# Altium schematic sheet Thermometer_Schematic.SchDoc
size 482 x 406 mm
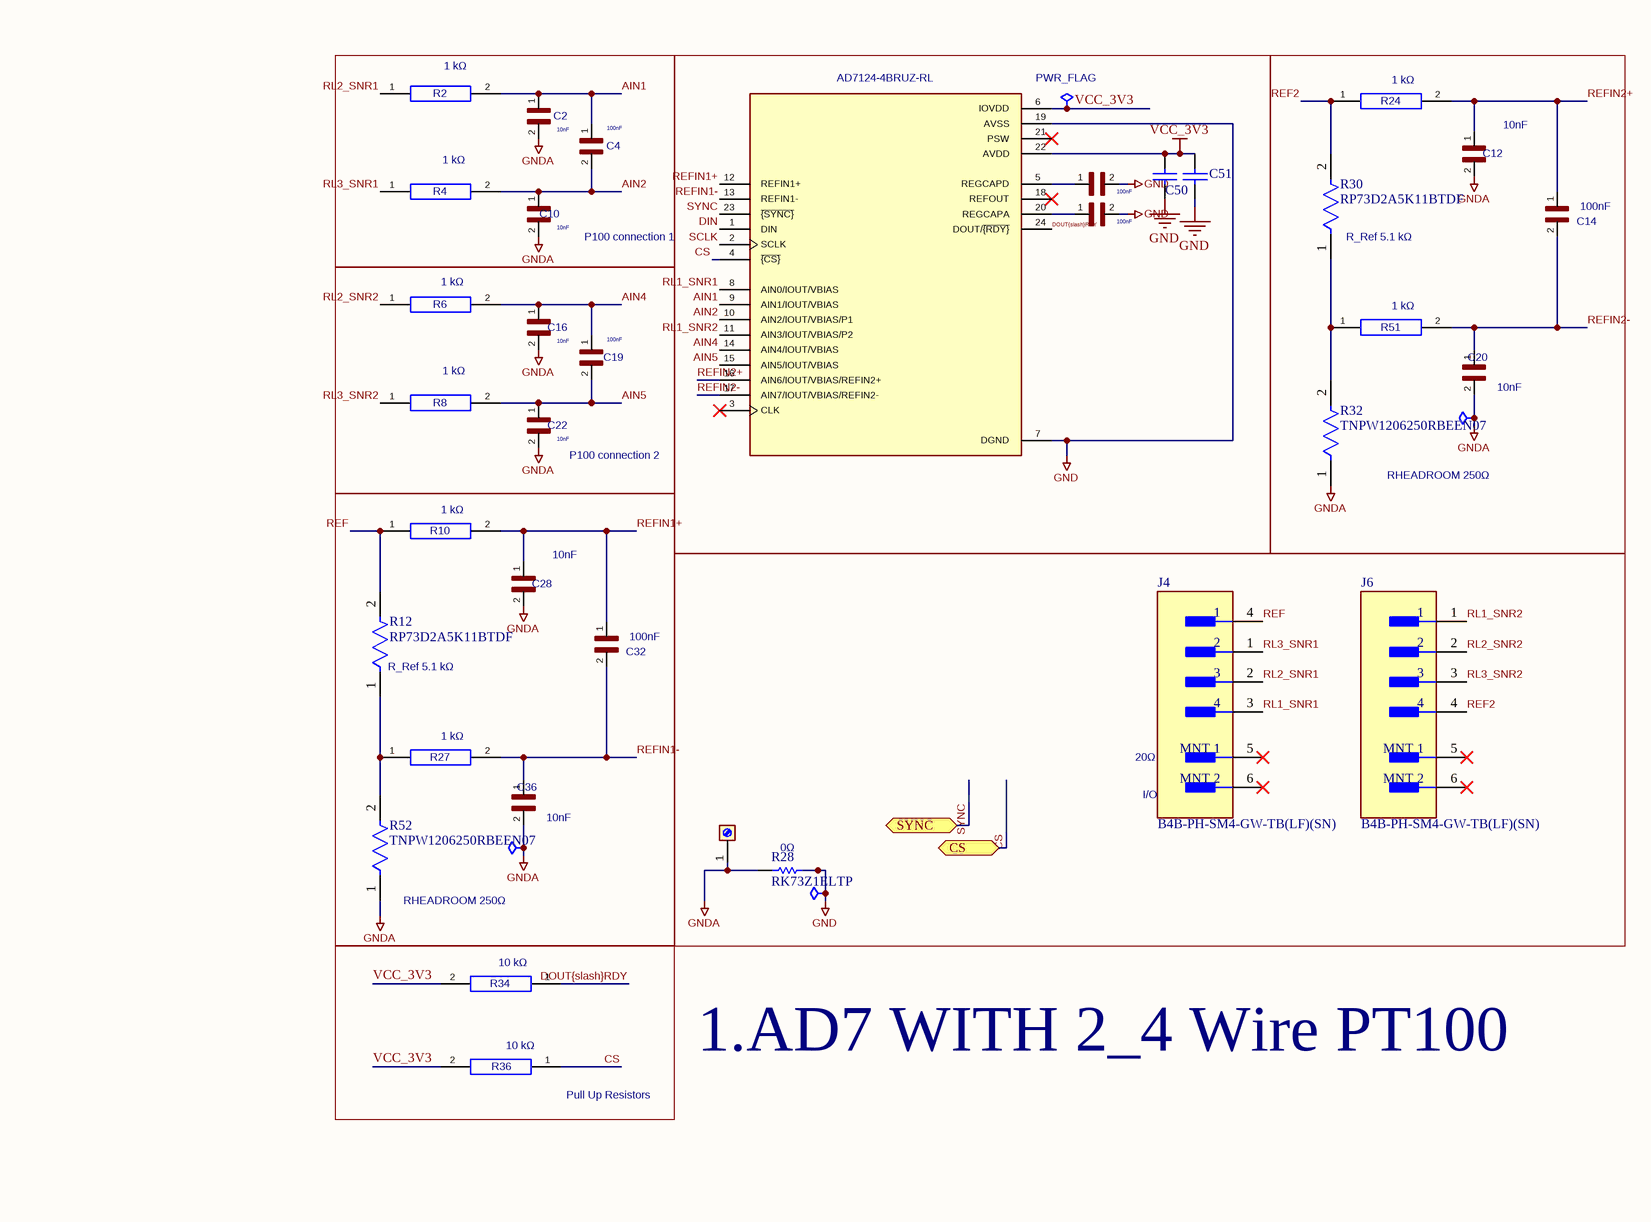
[diagram p0: Thermometer_Schematic.SchDoc, top left]
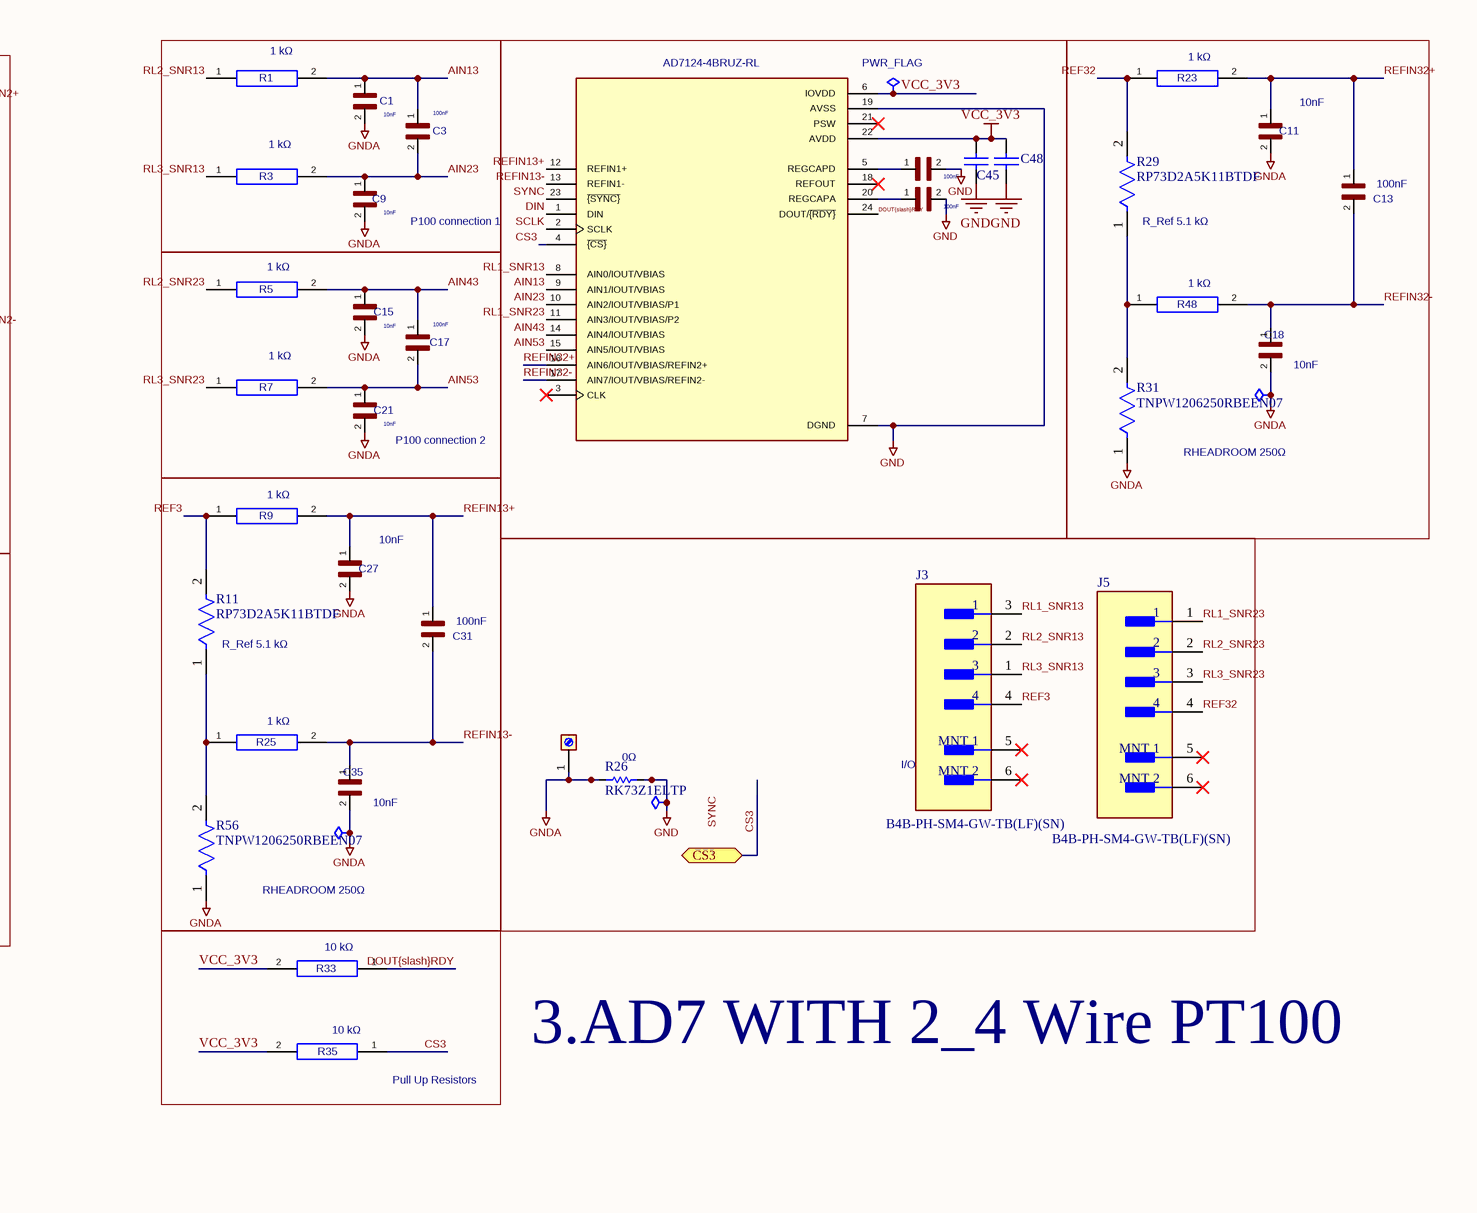
[diagram p1: Thermometer_Schematic.SchDoc, top right]
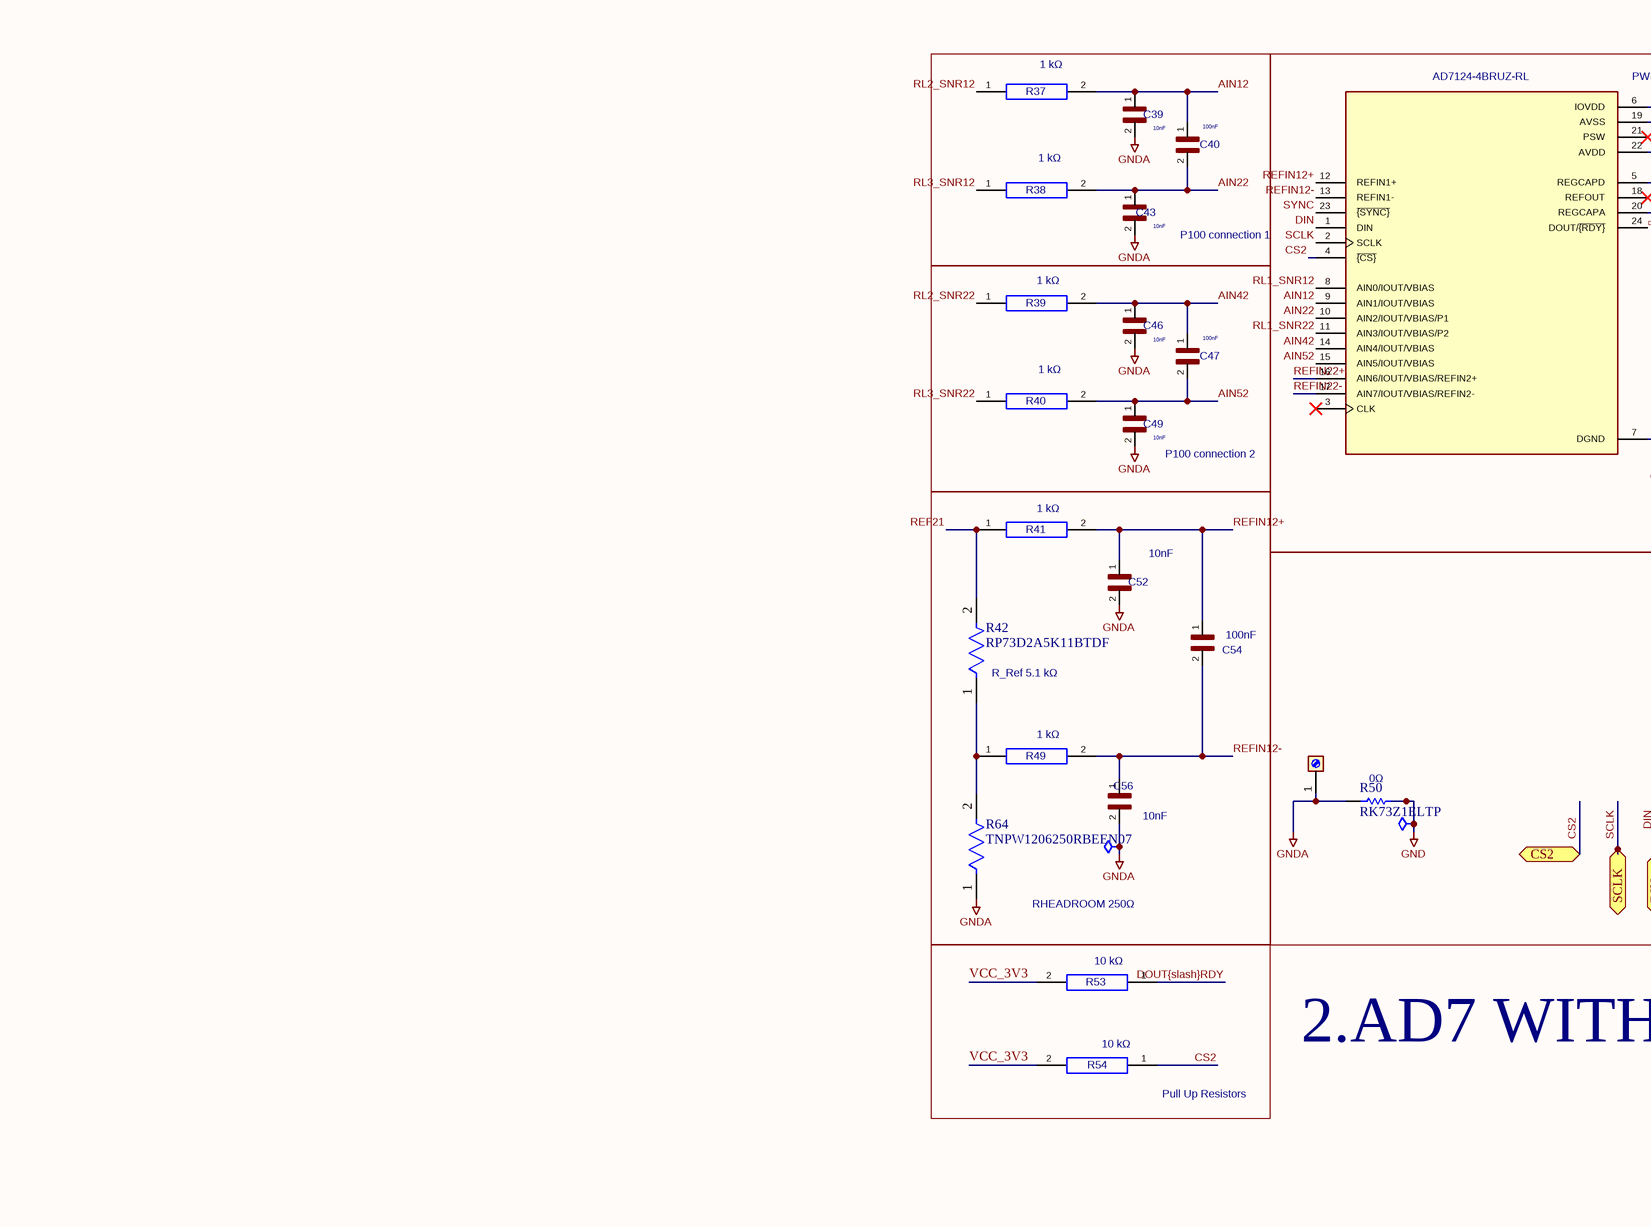
[diagram p2: Thermometer_Schematic.SchDoc, bottom left]
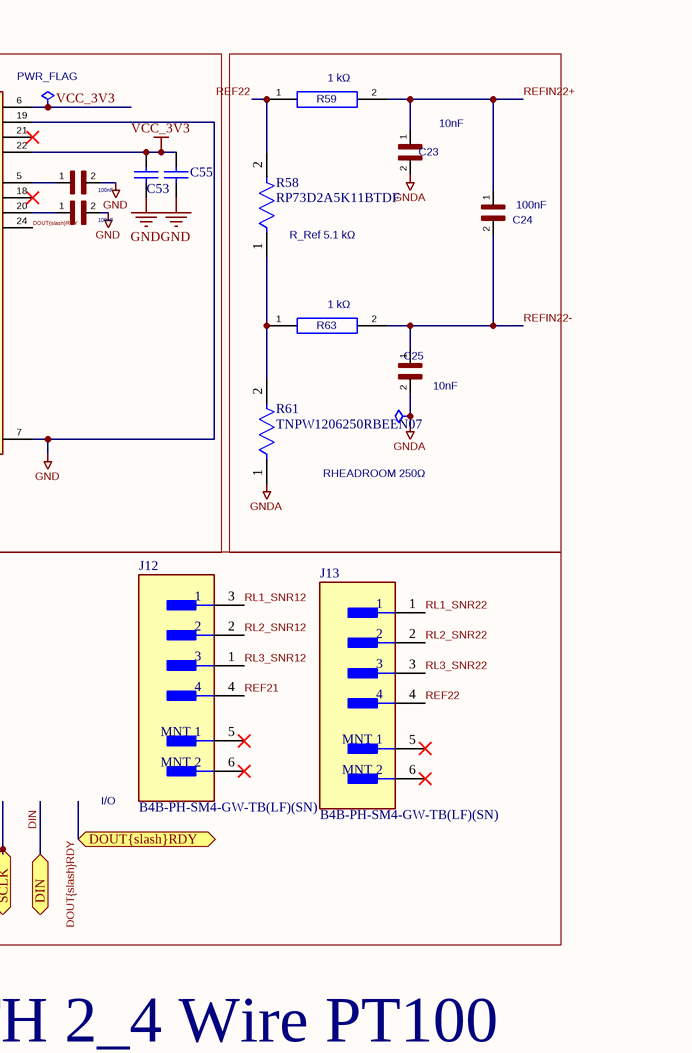
[diagram p3: Thermometer_Schematic.SchDoc, bottom right]

## Parts
#FLG02  PWR_FLAG  (value not drawn)  (graphical)
#FLG03  PWR_FLAG  (value not drawn)  (graphical)
#FLG05  PWR_FLAG  (graphical)
#FLG?#1  PWR_FLAG  (graphical)
#FLG?#2  PWR_FLAG  (value not drawn)  (graphical)
#FLG?#3  PWR_FLAG  (value not drawn)  (graphical)
#FLG?#4  PWR_FLAG  (value not drawn)  (graphical)
#FLG?#5  PWR_FLAG  (value not drawn)  (graphical)
#FLG?#6  PWR_FLAG  (graphical)
#FLG?#7  PWR_FLAG  (value not drawn)  (graphical)
#FLG?#8  PWR_FLAG  (value not drawn)  (graphical)
#FLG?#9  PWR_FLAG  (value not drawn)  (graphical)
C1  GCM155R71H103KA55D  [CAPC1005X55N]  (value not drawn)
C2  GCM155R71H103KA55D  [CAPC1005X55N]  (value not drawn)
C3  08055C104J4Z2A  [CAPC2012X94N]  (value not drawn)
C4  08055C104J4Z2A  [CAPC2012X94N]  (value not drawn)
C5  08055C104J4Z2A  [CAPC2012X94N]  (value not drawn)
C6  08055C104J4Z2A  [CAPC2012X94N]  (value not drawn)
C7  08055C104J4Z2A  [CAPC2012X94N]  (value not drawn)
C8  08055C104J4Z2A  [CAPC2012X94N]  (value not drawn)
C9  GCM155R71H103KA55D  [CAPC1005X55N]  (value not drawn)
C10  GCM155R71H103KA55D  [CAPC1005X55N]  (value not drawn)
C11  GCM155R71H103KA55D  [CAPC1005X55N]  (value not drawn)
C12  GCM155R71H103KA55D  [CAPC1005X55N]  (value not drawn)
C13  08055C104J4Z2A  [CAPC2012X94N]  (value not drawn)
C14  08055C104J4Z2A  [CAPC2012X94N]  (value not drawn)
C15  GCM155R71H103KA55D  [CAPC1005X55N]  (value not drawn)
C16  GCM155R71H103KA55D  [CAPC1005X55N]  (value not drawn)
C17  08055C104J4Z2A  [CAPC2012X94N]  (value not drawn)
C18  GCM155R71H103KA55D  [CAPC1005X55N]  (value not drawn)
C19  08055C104J4Z2A  [CAPC2012X94N]  (value not drawn)
C20  GCM155R71H103KA55D  [CAPC1005X55N]  (value not drawn)
C21  GCM155R71H103KA55D  [CAPC1005X55N]  (value not drawn)
C22  GCM155R71H103KA55D  [CAPC1005X55N]  (value not drawn)
C23  GCM155R71H103KA55D  [CAPC1005X55N]  (value not drawn)
C24  08055C104J4Z2A  [CAPC2012X94N]  (value not drawn)
C25  GCM155R71H103KA55D  [CAPC1005X55N]  (value not drawn)
C27  GCM155R71H103KA55D  [CAPC1005X55N]  (value not drawn)
C28  GCM155R71H103KA55D  [CAPC1005X55N]  (value not drawn)
C31  08055C104J4Z2A  [CAPC2012X94N]  (value not drawn)
C32  08055C104J4Z2A  [CAPC2012X94N]  (value not drawn)
C35  GCM155R71H103KA55D  [CAPC1005X55N]  (value not drawn)
C36  GCM155R71H103KA55D  [CAPC1005X55N]  (value not drawn)
C39  GCM155R71H103KA55D  [CAPC1005X55N]  (value not drawn)
C40  08055C104J4Z2A  [CAPC2012X94N]  (value not drawn)
C41  08055C104J4Z2A  [CAPC2012X94N]  (value not drawn)
C42  08055C104J4Z2A  [CAPC2012X94N]  (value not drawn)
C43  GCM155R71H103KA55D  [CAPC1005X55N]  (value not drawn)
C45  0805ZC105KAZ2A  [CAPC2013X140X50LL20T25]  (value not drawn)
C46  GCM155R71H103KA55D  [CAPC1005X55N]  (value not drawn)
C47  08055C104J4Z2A  [CAPC2012X94N]  (value not drawn)
C48  C0603X104M3RACTU  [CAPC1608X87X35LL15T15]  (value not drawn)
C49  GCM155R71H103KA55D  [CAPC1005X55N]  (value not drawn)
C50  0805ZC105KAZ2A  [CAPC2013X140X50LL20T25]  (value not drawn)
C51  C0603X104M3RACTU  [CAPC1608X87X35LL15T15]  (value not drawn)
C52  GCM155R71H103KA55D  [CAPC1005X55N]  (value not drawn)
C53  0805ZC105KAZ2A  [CAPC2013X140X50LL20T25]  (value not drawn)
C54  08055C104J4Z2A  [CAPC2012X94N]  (value not drawn)
C55  C0603X104M3RACTU  [CAPC1608X87X35LL15T15]  (value not drawn)
C56  GCM155R71H103KA55D  [CAPC1005X55N]  (value not drawn)
J3  B4B-PH-SM4-GW-TB(LF)(SN)  [FP-B4B-PH-SM4-GW-TB_LF_S-MFG]
J4  B4B-PH-SM4-GW-TB(LF)(SN)  [FP-B4B-PH-SM4-GW-TB_LF_S-MFG]
J5  B4B-PH-SM4-GW-TB(LF)(SN)  [FP-B4B-PH-SM4-GW-TB_LF_S-MFG]
J6  B4B-PH-SM4-GW-TB(LF)(SN)  [FP-B4B-PH-SM4-GW-TB_LF_S-MFG]
J7  GND  [PinHeader_1x01_P2.54mm_Vertical]  (value not drawn)
J9  GND  [PinHeader_1x01_P2.54mm_Vertical]  (value not drawn)
J12  B4B-PH-SM4-GW-TB(LF)(SN)  [FP-B4B-PH-SM4-GW-TB_LF_S-MFG]
J13  B4B-PH-SM4-GW-TB(LF)(SN)  [FP-B4B-PH-SM4-GW-TB_LF_S-MFG]
J14  GND  [PinHeader_1x01_P2.54mm_Vertical]  (value not drawn)
R1  CRCW08051K00JNEA  [RESC2012X50N]  (value not drawn)
R2  CRCW08051K00JNEA  [RESC2012X50N]  (value not drawn)
R3  CRCW08051K00JNEA  [RESC2012X50N]  (value not drawn)
R4  CRCW08051K00JNEA  [RESC2012X50N]  (value not drawn)
R5  CRCW08051K00JNEA  [RESC2012X50N]  (value not drawn)
R6  CRCW08051K00JNEA  [RESC2012X50N]  (value not drawn)
R7  CRCW08051K00JNEA  [RESC2012X50N]  (value not drawn)
R8  CRCW08051K00JNEA  [RESC2012X50N]  (value not drawn)
R9  CRCW08051K00JNEA  [RESC2012X50N]  (value not drawn)
R10  CRCW08051K00JNEA  [RESC2012X50N]  (value not drawn)
R11  RP73D2A5K11BTDF  [FP-RP732A-IPC_B]
R12  RP73D2A5K11BTDF  [FP-RP732A-IPC_B]
R23  CRCW08051K00JNEA  [RESC2012X50N]  (value not drawn)
R24  CRCW08051K00JNEA  [RESC2012X50N]  (value not drawn)
R25  CRCW08051K00JNEA  [RESC2012X50N]  (value not drawn)
R26  RK73Z1ELTP  [RESC1005X40X25NL10T10]
R27  CRCW08051K00JNEA  [RESC2012X50N]  (value not drawn)
R28  RK73Z1ELTP  [RESC1005X40X25NL10T10]
R29  RP73D2A5K11BTDF  [FP-RP732A-IPC_B]
R30  RP73D2A5K11BTDF  [FP-RP732A-IPC_B]
R31  TNPW1206250RBEEN07  [FP-TNPW1206-e3-MFG]
R32  TNPW1206250RBEEN07  [FP-TNPW1206-e3-MFG]
R33  RT0402FRE0710KL  [RESC1005X35N]  (value not drawn)
R34  RT0402FRE0710KL  [RESC1005X35N]  (value not drawn)
R35  RT0402FRE0710KL  [RESC1005X35N]  (value not drawn)
R36  RT0402FRE0710KL  [RESC1005X35N]  (value not drawn)
R37  CRCW08051K00JNEA  [RESC2012X50N]  (value not drawn)
R38  CRCW08051K00JNEA  [RESC2012X50N]  (value not drawn)
R39  CRCW08051K00JNEA  [RESC2012X50N]  (value not drawn)
R40  CRCW08051K00JNEA  [RESC2012X50N]  (value not drawn)
R41  CRCW08051K00JNEA  [RESC2012X50N]  (value not drawn)
R42  RP73D2A5K11BTDF  [FP-RP732A-IPC_B]
R48  CRCW08051K00JNEA  [RESC2012X50N]  (value not drawn)
R49  CRCW08051K00JNEA  [RESC2012X50N]  (value not drawn)
R50  RK73Z1ELTP  [RESC1005X40X25NL10T10]
R51  CRCW08051K00JNEA  [RESC2012X50N]  (value not drawn)
R52  TNPW1206250RBEEN07  [FP-TNPW1206-e3-MFG]
R53  RT0402FRE0710KL  [RESC1005X35N]  (value not drawn)
R54  RT0402FRE0710KL  [RESC1005X35N]  (value not drawn)
R56  TNPW1206250RBEEN07  [FP-TNPW1206-e3-MFG]
R58  RP73D2A5K11BTDF  [FP-RP732A-IPC_B]
R59  CRCW08051K00JNEA  [RESC2012X50N]  (value not drawn)
R61  TNPW1206250RBEEN07  [FP-TNPW1206-e3-MFG]
R63  CRCW08051K00JNEA  [RESC2012X50N]  (value not drawn)
R64  TNPW1206250RBEEN07  [FP-TNPW1206-e3-MFG]
U1  AD7124-4BRUZ-RL  [SOP65P640X120-24N]
U2  AD7124-4BRUZ-RL  [SOP65P640X120-24N]
U5  AD7124-4BRUZ-RL  [SOP65P640X120-24N]

## Ports
CS2 (bidir), CS3 (bidir), CS (bidir), DIN (bidir), DOUT{slash}RDY (bidir), SCLK (bidir), SYNC (bidir)

## Nets
GND: #FLG03.1 #FLG?#4.1 #FLG?#8.1 C5.2 C6.2 C7.2 C8.2 C41.2 C42.2 C45.1 C48.1 C50.1 C51.1 C53.1 C55.1 R26.2 R28.2 R50.2 U1.7(DGND) U1.19(AVSS) U2.7(DGND) U2.19(AVSS) U5.7(DGND) U5.19(AVSS)
GNDA: #FLG02.1 #FLG?#2.1 #FLG?#3.1 #FLG?#5.1 #FLG?#7.1 #FLG?#9.1 C1.2 C2.2 C9.2 C10.2 C11.2 C12.2 C15.2 C16.2 C18.2 C20.2 C21.2 C22.2 C23.2 C25.2 C27.2 C28.2 C35.2 C36.2 C39.2 C43.2 C46.2 C49.2 C52.2 C56.2 J7.1(Pin_1) J9.1(Pin_1) J14.1(Pin_1) R26.1 R28.1 R31.1 R32.1 R50.1 R52.1 R56.1 R61.1 R64.1
VCC_3V3: #FLG05.1 #FLG?#1.1 #FLG?#6.1 C45.2 C48.2 C50.2 C51.2 C53.2 C55.2 R33.2 R34.2 R35.2 R36.2 R53.2 R54.2 U1.6(IOVDD) U1.22(AVDD) U2.6(IOVDD) U2.22(AVDD) U5.6(IOVDD) U5.22(AVDD)
AIN1: C2.1 C4.1 R2.2 U2.9(AIN1/IOUT/VBIAS)
AIN2: C4.2 C10.1 R4.2 U2.10(AIN2/IOUT/VBIAS/P1)
AIN4: C16.1 C19.1 R6.2 U2.14(AIN4/IOUT/VBIAS)
AIN5: C19.2 C22.1 R8.2 U2.15(AIN5/IOUT/VBIAS)
AIN12: C39.1 C40.1 R37.2 U5.9(AIN1/IOUT/VBIAS)
AIN13: C1.1 C3.1 R1.2 U1.9(AIN1/IOUT/VBIAS)
AIN22: C40.2 C43.1 R38.2 U5.10(AIN2/IOUT/VBIAS/P1)
AIN23: C3.2 C9.1 R3.2 U1.10(AIN2/IOUT/VBIAS/P1)
AIN42: C46.1 C47.1 R39.2 U5.14(AIN4/IOUT/VBIAS)
AIN43: C15.1 C17.1 R5.2 U1.14(AIN4/IOUT/VBIAS)
AIN52: C47.2 C49.1 R40.2 U5.15(AIN5/IOUT/VBIAS)
AIN53: C17.2 C21.1 R7.2 U1.15(AIN5/IOUT/VBIAS)
CS: R36.1 U2.4(~{{CS}}) ; port CS
CS2: R54.1 U5.4(~{{CS}}) ; port CS2
CS3: R35.1 U1.4(~{{CS}}) ; port CS3
DIN: U1.1(DIN) U2.1(DIN) U5.1(DIN) ; port DIN
DOUT{slash}RDY: R33.1 R34.1 R53.1 U1.24(DOUT/~{{RDY}}) U2.24(DOUT/~{{RDY}}) U5.24(DOUT/~{{RDY}}) ; port DOUT{slash}RDY
REF: J4.4 R10.1 R12.2
REF2: J6.4 R24.1 R30.2
REF3: J3.4 R9.1 R11.2
REF21: J12.4 R41.1 R42.2
REF22: J13.4 R58.2 R59.1
REF32: J5.4 R23.1 R29.2
REFIN1+: C28.1 C32.1 R10.2 U2.12(REFIN1+)
REFIN1-: C32.2 C36.1 R27.2 U2.13(REFIN1-)
REFIN2+: C12.1 C14.1 R24.2 U2.16(AIN6/IOUT/VBIAS/REFIN2+)
REFIN2-: C14.2 C20.1 R51.2 U2.17(AIN7/IOUT/VBIAS/REFIN2-)
REFIN12+: C52.1 C54.1 R41.2 U5.12(REFIN1+)
REFIN12-: C54.2 C56.1 R49.2 U5.13(REFIN1-)
REFIN13+: C27.1 C31.1 R9.2 U1.12(REFIN1+)
REFIN13-: C31.2 C35.1 R25.2 U1.13(REFIN1-)
REFIN22+: C23.1 C24.1 R59.2 U5.16(AIN6/IOUT/VBIAS/REFIN2+)
REFIN22-: C24.2 C25.1 R63.2 U5.17(AIN7/IOUT/VBIAS/REFIN2-)
REFIN32+: C11.1 C13.1 R23.2 U1.16(AIN6/IOUT/VBIAS/REFIN2+)
REFIN32-: C13.2 C18.1 R48.2 U1.17(AIN7/IOUT/VBIAS/REFIN2-)
RL1_SNR1: J4.3 U2.8(AIN0/IOUT/VBIAS)
RL1_SNR2: J6.1 U2.11(AIN3/IOUT/VBIAS/P2)
RL1_SNR12: J12.3 U5.8(AIN0/IOUT/VBIAS)
RL1_SNR13: J3.3 U1.8(AIN0/IOUT/VBIAS)
RL1_SNR22: J13.1 U5.11(AIN3/IOUT/VBIAS/P2)
RL1_SNR23: J5.1 U1.11(AIN3/IOUT/VBIAS/P2)
RL2_SNR1: J4.2 R2.1
RL2_SNR2: J6.2 R6.1
RL2_SNR12: J12.2 R37.1
RL2_SNR13: J3.2 R1.1
RL2_SNR22: J13.2 R39.1
RL2_SNR23: J5.2 R5.1
RL3_SNR1: J4.1 R4.1
RL3_SNR2: J6.3 R8.1
RL3_SNR12: J12.1 R38.1
RL3_SNR13: J3.1 R3.1
RL3_SNR22: J13.3 R40.1
RL3_SNR23: J5.3 R7.1
SCLK: U1.2(SCLK) U2.2(SCLK) U5.2(SCLK) ; port SCLK
SYNC: U1.23(~{{SYNC}}) U2.23(~{{SYNC}}) U5.23(~{{SYNC}}) ; port SYNC
NetC5_1: C5.1 U1.5(REGCAPD)
NetC6_1: C6.1 U2.5(REGCAPD)
NetC7_1: C7.1 U1.20(REGCAPA)
NetC8_1: C8.1 U2.20(REGCAPA)
NetC41_1: C41.1 U5.5(REGCAPD)
NetC42_1: C42.1 U5.20(REGCAPA)
NetR11_1: R11.1 R25.1 R56.2
NetR12_1: R12.1 R27.1 R52.2
NetR29_1: R29.1 R31.2 R48.1
NetR30_1: R30.1 R32.2 R51.1
NetR42_1: R42.1 R49.1 R64.2
NetR58_1: R58.1 R61.2 R63.1

Not connected (* = marked no-connect by the designer): J3 5(MNT_1)* 6(MNT_2)*; J4 5(MNT_1)* 6(MNT_2)*; J5 5(MNT_1)* 6(MNT_2)*; J6 5(MNT_1)* 6(MNT_2)*; J12 5(MNT_1)* 6(MNT_2)*; J13 5(MNT_1)* 6(MNT_2)*; U1 3(CLK)* 18(REFOUT)* 21(PSW)*; U2 3(CLK)* 18(REFOUT)* 21(PSW)*; U5 3(CLK)* 18(REFOUT)* 21(PSW)*

## Notes on the sheet
- (near R1) 1 kΩ
- (near R23) 1 kΩ
- (near R2) 1 kΩ
- 10nF
- (near C4) 100nF
- (near R24) 1 kΩ
- (near C12) 10nF
- (near C3) 100nF
- (near C11) 10nF
- (near R4) 1 kΩ
- 100nF
- (near C14) 100nF
- (near R3) 1 kΩ
- (near C9) 10nF
- (near C7) 100nF
- (near C13) 100nF
- (near R6) 1 kΩ
- (near C10) 10nF
- P100 connection 1
- (near C8) 100nF
- (near R30) R_Ref
  5.1 kΩ
- (near R5) 1 kΩ
- (near R29) R_Ref
  5.1 kΩ
- (near R48) 1 kΩ
- (near C19) 100nF
- (near R51) 1 kΩ
- (near R7) 1 kΩ
- (near C17) 100nF
- (near R8) 1 kΩ
- (near C22) 10nF
- (near C21) 10nF
- (near C21) P100 connection 2
- (near R10) 1 kΩ
- (near C22) P100 connection 2
- RHEADROOM 250Ω
- (near R9) 1 kΩ
- (near C28) 10nF
- (near C27) 10nF
- (near C32) 100nF
- (near R11) R_Ref
  5.1 kΩ
- (near C31) 100nF
- (near R12) R_Ref
  5.1 kΩ
- (near R27) 1 kΩ
- (near R25) 1 kΩ
- 20Ω
- I/O
- (near R26) 0Ω
- (near R28) 0Ω
- (near R52) RHEADROOM 250Ω
- (near R34) 10 kΩ
- (near R33) 10 kΩ
- (near R35) 10 kΩ
- (near R36) 10 kΩ
- (near R36) Pull Up Resistors
- 1.AD7 WITH 2_4 Wire PT100
- (near R35) Pull Up Resistors
- 3.AD7 WITH 2_4 Wire PT100
- (near R37) 1 kΩ
- (near R59) 1 kΩ
- (near R38) 1 kΩ
- (near C40) 100nF
- (near C23) 10nF
- (near C43) 10nF
- (near C42) 100nF
- (near C24) 100nF
- (near R39) 1 kΩ
- (near R58) R_Ref
  5.1 kΩ
- (near R63) 1 kΩ
- (near R40) 1 kΩ
- (near C47) 100nF
- (near C49) 10nF
- (near C49) P100 connection 2
- (near R41) 1 kΩ
- (near C52) 10nF
- (near R42) R_Ref
  5.1 kΩ
- (near C54) 100nF
- (near R49) 1 kΩ
- (near R50) 0Ω
- (near R53) 10 kΩ
- (near R54) 10 kΩ
- 2.AD7 WITH 2_4 Wire PT100
- (near R54) Pull Up Resistors
- Labels drawn without touching a wire or pin: SYNC
- 1
- 2
- 3
- 4
- 5
- 6
- A
- B
- C
- D
- Title: Схема за термометър с AD7124-4BRUZ-RL
- File: Thermometer Schematic.kicad_sch
- Sheet: /
- Вълкан Павлов
- KiCad E.D.A.  kicad (5.1.4)-1
- Size: A4
- Date: 10.07.2024
- Rev: 0.0
- Id: 1/1

## Library data of the parts
C1 C2 C9-C12 C15 C16 C18 C20-C23 C25 C27 C28 C35 C36 C39 C43 C46 C49 C52 C56 = GCM155R71H103KA55D: MF: Murata; Description_1: \n10000 pF ±10% 50V Ceramic Capacitor X7R 0402 (1005 Metric)\n; PACKAGE: 1005 Taiyo Yuden; PRICE: None; Package: 1005 Taiyo Yuden; Check_prices: https://www.snapeda.com/parts/GCM155R71H103KA55D/Murata+Electronics+North+America/view-part/?ref=eda; Price: None; SnapEDA_Link: https://www.snapeda.com/parts/GCM155R71H103KA55D/Murata+Electronics+North+America/view-part/?ref=snap; MP: GCM155R71H103KA55D; Purchase-URL: https://www.snapeda.com/api/url_track_click_mouser/?unipart_id=597699&manufacturer=Murata&part_name=GCM155R71H103KA55D&search_term=gcm155r71h103ka55d; Availability: In Stock; AVAILABILITY: In Stock; PURCHASE-URL: https://pricing.snapeda.com/search/part/GCM155R71H103KA55D/?ref=eda; Value: GCM155R71H103KA55D; Footprint: GCM155R71H103KA55D:CAPC1005X55N
C3-C8 C13 C14 C17 C19 C24 C31 C32 C40-C42 C47 C54 = 08055C104J4Z2A: MF: KYOCERA AVX; Description_1: \nCAP CER 0.1UF 50V X7R 0805\n; Package: 2012 AVX; Price: None; SnapEDA_Link: https://www.snapeda.com/parts/08055C104J4Z2A/Kyocera/view-part/?ref=snap; MP: 08055C104J4Z2A; Purchase-URL: https://www.snapeda.com/api/url_track_click_mouser/?unipart_id=11866989&manufacturer=KYOCERA AVX&part_name=08055C104J4Z2A&search_term=08055c104j4z2a; Availability: In Stock; Check_prices: https://www.snapeda.com/parts/08055C104J4Z2A/Kyocera/view-part/?ref=eda; Value: 08055C104J4Z2A; Footprint: 08055C104J4Z2A:CAPC2012X94N
C45 C50 C53 = CMP-2007-04674-1: Manufacturer: AVX Interconnect / Elco; Part Number: 0805ZC105KAZ2A
C48 C51 C55 = CMP-2006-03301-1: Manufacturer: Kemet; Part Number: C0603X104M3RACTU
J3-J6 J12 J13 = CMP-17439-000485-1: Connector header SMT, 4 Contacts, 2A, 100V, top entry male pins
J7 J9 J14 = Screw_Terminal_01x01: Value: GND; Footprint: Connector_PinHeader_2.54mm:PinHeader_1x01_P2.54mm_Vertical
R1-R10 R23-R25 R27 R37-R41 R48 R49 R51 R59 R63 = CRCW08051K00JNEA_1: MF: Vishay Dale; Description_1: \nResistor;Thick Film;1 Kilohms;0.125 W;5%;SMT;0805;TCR 73 ppm/DegC;Tape and Reel | Vishay Dale CRCW08051K00JNEA\n; Package: 2012 Vishay; Price: None; SnapEDA_Link: https://www.snapeda.com/parts/CRCW08051K00JNEA/Vishay+Dale/view-part/?ref=snap; MP: CRCW08051K00JNEA; Purchase-URL: https://www.snapeda.com/api/url_track_click_mouser/?unipart_id=480968&manufacturer=Vishay Dale&part_name=CRCW08051K00JNEA&search_term=crcw08051k00jnea; Availability: In Stock; Check_prices: https://www.snapeda.com/parts/CRCW08051K00JNEA/Vishay+Dale/view-part/?ref=eda; Value: CRCW08051K00JNEA; Footprint: CRCW08051K00JNEA:RESC2012X50N
R11 R12 R29 R30 R42 R58 = CMP-03211-009605-2: Surface Mount Resistors, Precision Resistor, 2 Terminations, Size Code 0805, Cut Tape Length, .1%, Thin Film, 10K 0.1% 10PPM; Number of Resistors: 1; Voltage Rating: 150V; Power Rating: 125mW; Temperature Coefficient: 15ppm/°C; Resistance: 5.11kR; Case/Package: 0805; Tolerance: 0.1%; Case Code (Metric): 2012; Termination: Solder; Weight: 0.000194oz; Min Operating Temperature: -55°C; Width: 1.25mm; Max Operating Temperature: 155°C; Packaging: Tape and Reel; ELV: Compliant; Height: 0.55mm; Number of Terminations: 2; Length: 2mm; Mount: Surface Mount; Package Quantity: 1000; Case Code (Imperial): 0805
R26 R28 R50 = CMP-2002-04568-1: Manufacturer: KOA Speer; Part Number: RK73Z1ELTP
R31 R32 R52 R56 R61 R64 = CMP-02407-012799-1: Res Thnflm 1206 250R Ohm 0.1% 1/4W 25PPM/C SMD; Power Rating: 250mW; Temperature Coefficient: 25ppm/°C; Voltage Rating: 200V; Resistance: 250R; Length: 3.2mm; Package Quantity: 5000; Height: 0.55mm; Weight: 0.000571oz; Resistor Type: Thin Film; Tolerance: 0.1%; Packaging: Tape and Reel; Case/Package: 1206; Contact Plating: Tin; Min Operating Temperature: -55°C; Case Code (Imperial): 1206; Case Code (Metric): 3216; Width: 1.6mm; Termination: SMD/SMT; Series: TNPW e3; Max Operating Temperature: 125°C
R33-R36 R53 R54 = RT0402FRE0710KL_1: MF: Yageo; Description_1: \n10 kOhms ±1% 0.063W, 1/16W Chip Resistor 0402 (1005 Metric) - Thin Film\n; Package: 1005 Yageo; Price: None; SnapEDA_Link: https://www.snapeda.com/parts/RT0402FRE0710KL/Yageo/view-part/?ref=snap; MP: RT0402FRE0710KL; Availability: In Stock; Check_prices: https://www.snapeda.com/parts/RT0402FRE0710KL/Yageo/view-part/?ref=eda; Value: RT0402FRE0710KL; Footprint: RT0402FRE0710KL:RESC1005X35N
U1 U2 U5 = AD7124-4BRUZ-RL: MF: Analog Devices; Description_1: \n4-Channel, Low Noise, Low Power, 24-Bit, Sigma-Delta ADC with PGA and Reference\n; Package: TSSOP-24 Analog Devices; Price: None; Check_prices: https://www.snapeda.com/parts/AD7124-4BRUZ-RL/Analog+Devices/view-part/?ref=eda; STANDARD: IPC7351B; PARTREV: D; SnapEDA_Link: https://www.snapeda.com/parts/AD7124-4BRUZ-RL/Analog+Devices/view-part/?ref=snap; MP: AD7124-4BRUZ-RL; Purchase-URL: https://www.snapeda.com/api/url_track_click_mouser/?unipart_id=1019837&manufacturer=Analog Devices&part_name=AD7124-4BRUZ-RL&search_term=ad7124_4bruz_rl; Availability: In Stock; MANUFACTURER: Analog Devices; Value: AD7124-4BRUZ-RL; Footprint: AD7124-4BRUZ-RL:SOP65P640X120-24N
#FLG02 #FLG03 #FLG05 #FLG?#1-#FLG?#9 = PWR_FLAG: Value: PWR_FLAG